# Altium schematic sheet RTC.SchDoc
size A4
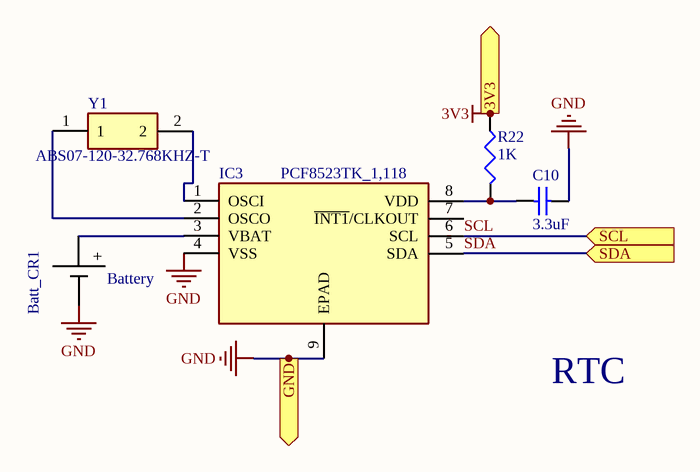
[diagram p0: RTC.SchDoc]

## Parts
Batt_CR1  Battery  [Battery 1220]
C10  3.3uF  [1608[0603]]
IC3  PCF8523TK_1,118  [SON80P400X400X100-9N]
R22  1K  [J1-0603]
Y1  ABS07-120-32.768KHZ-T  [ABS-07]

## Ports
3V3 (in), GND (in), SCL (in), SDA (in)

## Nets
3V3: R22.1 ; port 3V3
GND: Batt_CR1.2(-) C10.2 IC3.4(VSS) IC3.9(EPAD) ; port GND
SCL: IC3.6(SCL) ; port SCL
SDA: IC3.5(SDA) ; port SDA
NetBatt_CR1_1: Batt_CR1.1(+) IC3.3(VBAT)
NetC10_1: C10.1 IC3.8(VDD) R22.2
NetIC3_1: IC3.1(OSCI) Y1.2
NetIC3_2: IC3.2(OSCO) Y1.1

Not connected (* = marked no-connect by the designer): IC3 7(~{INT1}/CLKOUT)

## Notes on the sheet
- RTC

## Library data of the parts
Batt_CR1 = 1074: Undefined or Miscellaneous; Manufacturer_Name: Keystone Electronics; Datasheet Link: https://componentsearchengine.com/Datasheets/1/1074.pdf; Height: 18.3mm; Mouser Part Number: 534-1074; Mouser Price/Stock: https://www.mouser.com/Search/Refine.aspx?Keyword=534-1074; Manufacturer_Part_Number: 1074
C10 = Cap Semi: Capacitor (Semiconductor SIM Model); Published: 8-Jun-2000; LatestRevisionDate: 29-May-2009; LatestRevisionNote: IPC-7351 Footprint Added.; PackageReference: C1206; Publisher: Altium Limited; PackageDescription: Chip Capacitor; Value: 3.3uF
IC3 = PCF8523TK_1,118: Integrated Circuit; Manufacturer_Name: Nexperia; Manufacturer_Part_Number: PCF8523TK/1,118; Datasheet Link: https://www.arrow.com/en/products/pcf8523tk1118/nxp-semiconductors; Height: 1mm; Mouser Part Number: 771-PCF8523TK/1118; Mouser Price/Stock: https://www.mouser.com/Search/Refine.aspx?Keyword=771-PCF8523TK%2F1118
R22 = Res3: Resistor; Published: 8-Jun-2000; LatestRevisionDate: 29-May-2009; LatestRevisionNote: IPC-7351 Footprint Added.; PackageReference: J1-0603; Publisher: Altium Limited; PackageDescription: Chip Resistor; Value: 1K
Y1 = ABS07-120-32.768KHZ-T: Crystal or Oscillator; Manufacturer_Name: ABRACON; Datasheet Link: http://www.abracon.com/Resonators/ABS07-120-32.768kHz-T.pdf; Manufacturer_Part_Number: ABS07-120-32.768KHZ-T; Mouser Part Number: 815-ABS0712032.768KT; Mouser Price/Stock: https://www.mouser.com/Search/Refine.aspx?Keyword=815-ABS0712032.768KT; RS Part Number: 1712688P; RS Price/Stock: http://uk.rs-online.com/web/p/products/1712688P